# Altium schematic sheet Project Overview.SchDoc
size B
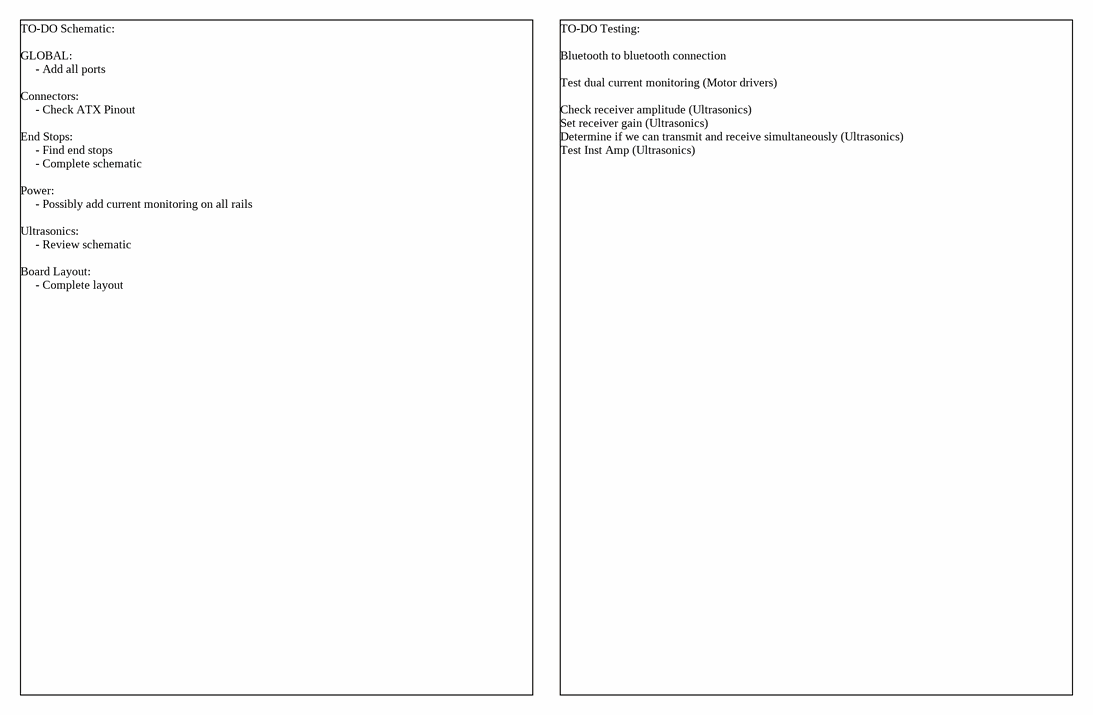
[diagram p0: Project Overview.SchDoc]

## Notes on the sheet
- TO-DO Schematic:
  GLOBAL:
  - Add all ports
  Connectors:
  - Check ATX Pinout
  End Stops:
  - Find end stops
  - Complete schematic
  Power:
  - Possibly add current monitoring on all rails
  Ultrasonics:
  - Review schematic
  Board Layout:
  - Complete layout
- TO-DO Testing:
  Bluetooth to bluetooth connection
  Test dual current monitoring (Motor drivers)
  Check receiver amplitude (Ultrasonics)
  Set receiver gain (Ultrasonics)
  Determine if we can transmit and receive simultaneously (Ultrasonics)
  Test Inst Amp (Ultrasonics)